# Altium schematic sheet YA-S-Microcontroller-V1.0.SchDoc: Yet Another IoT BroadRouter
size A4; Revision: 1.0; SheetNumber: 3; SheetTotal: 5
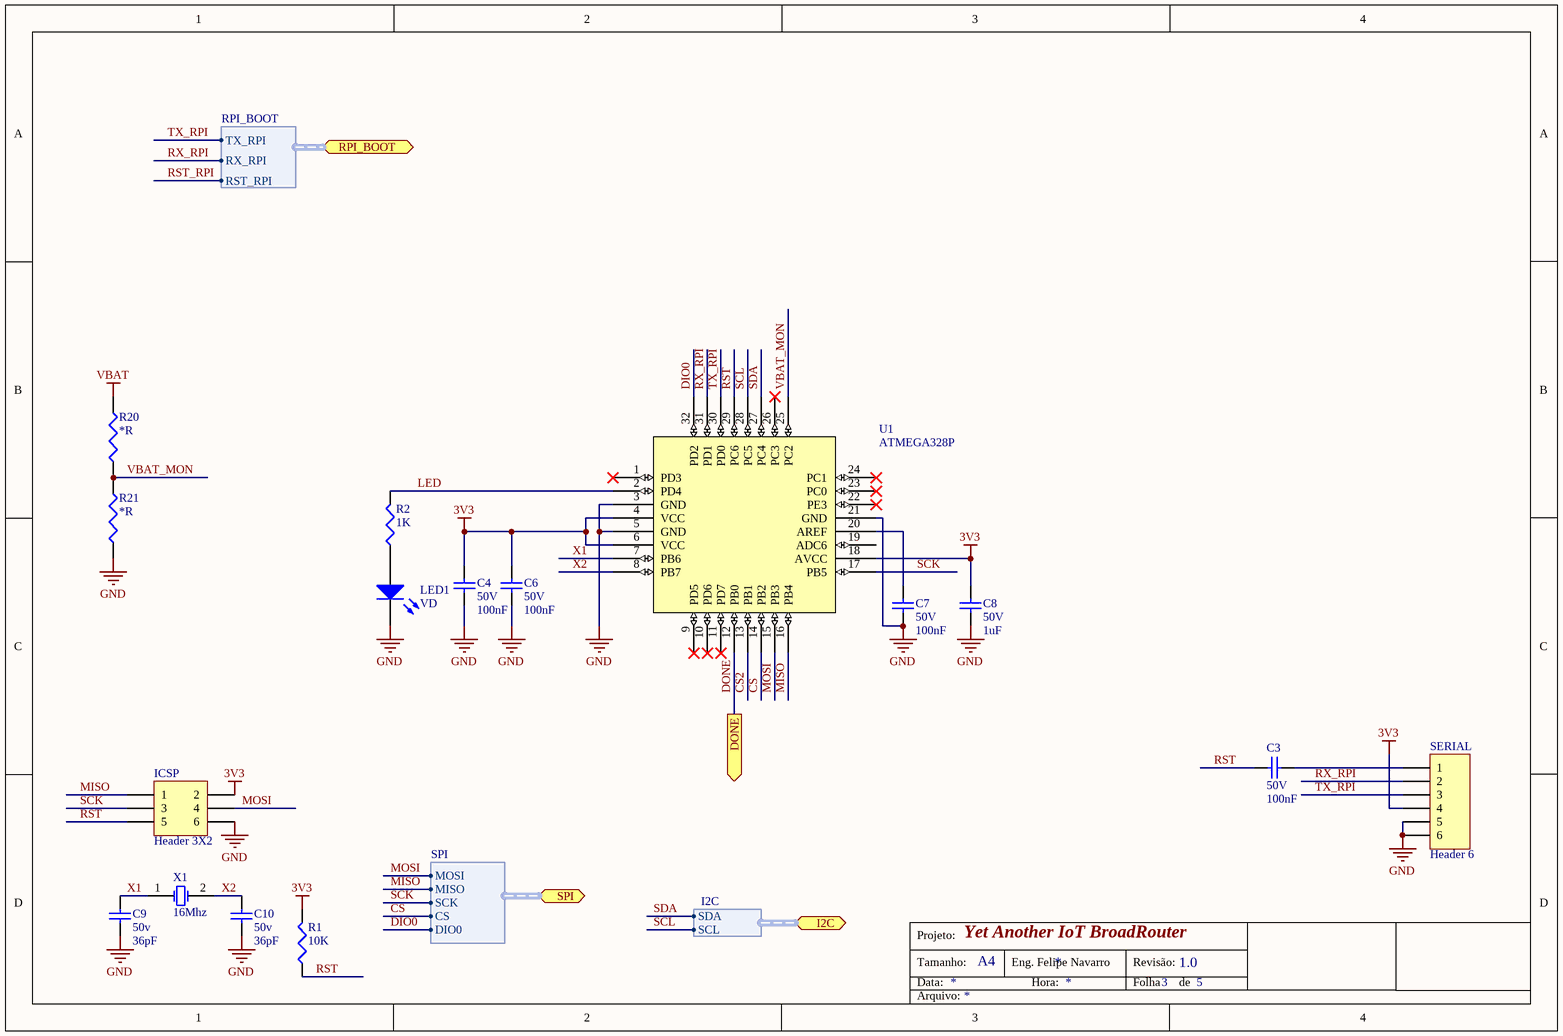
[diagram p0: YA-S-Microcontroller-V1.0.SchDoc]

## Parts
C3  value 100nF  Tensão: 50V  [CC0603]  (hidden comment: Capacitor Cerâmico)
C4  value 100nF  Tensão: 50V  [CC0603]  (hidden comment: Capacitor Cerâmico)
C6  value 100nF  Tensão: 50V  [CC0603]  (hidden comment: Capacitor Cerâmico)
C7  value 100nF  Tensão: 50V  [CC0603]  (hidden comment: Capacitor Cerâmico)
C8  value 1uF  Tensão: 50V  [CC0603]  (hidden comment: Capacitor Cerâmico)
C9  value 36pF  Tensão: 50v  [CC0603]  (hidden comment: Capacitor Cerâmico)
C10  value 36pF  Tensão: 50v  [CC0603]  (hidden comment: Capacitor Cerâmico)
ICSP  Header 3X2  [CONN HDR2X3]
LED1  value VD  [LED 0603]  (hidden comment: LED)
R1  value 10K  [CC0603]  (hidden comment: Resistor)
R2  value 1K  [CC0603]  (hidden comment: Resistor)
R20  value *R  [CC0603]  (hidden comment: Resistor)
R21  value *R  [CC0603]  (hidden comment: Resistor)
SERIAL  Header 6  [CONN HDR1X6]
U1  ATMEGA328P  [TQFP-32N]
X1  16Mhz  [HC/49US]

## Ports
DONE (out), I2C (harness I2C), RPI_BOOT (harness RPI_BOOT), SPI (harness SPI)

## Harnesses
I2C: SDA, SCL
SPI: MOSI, MISO, SCK, CS, DIO0
RPI_BOOT: TX_RPI, RX_RPI, RST_RPI

## Nets
3V3: C4.2 C6.2 C8.2 ICSP.2 R1.2 SERIAL.4 U1.4(VCC) U1.6(VCC) U1.18(AVCC)
GND: C4.1 C6.1 C7.1 C8.1 C9.1 C10.1 ICSP.6 LED1.2(K) R21.1 SERIAL.5 SERIAL.6 U1.3(GND) U1.5(GND) U1.21(GND)
VBAT: R20.2
CS: U1.14(PB2) ; port SPI.CS
CS2: U1.13(PB1)
DIO0: U1.32(PD2) ; port SPI.DIO0
DONE: U1.12(PB0) ; port DONE
LED: R2.2 U1.2(PD4)
MISO: ICSP.1 U1.16(PB4) ; port SPI.MISO
MOSI: ICSP.4 U1.15(PB3) ; port SPI.MOSI
RST: C3.2 ICSP.5 R1.1 U1.29(PC6)
RST_RPI: port RPI_BOOT.RST_RPI
RX_RPI: SERIAL.2 U1.31(PD1) ; port RPI_BOOT.RX_RPI
SCK: ICSP.3 U1.17(PB5) ; port SPI.SCK
SCL: U1.28(PC5) ; port I2C.SCL
SDA: U1.27(PC4) ; port I2C.SDA
TX_RPI: SERIAL.3 U1.30(PD0) ; port RPI_BOOT.TX_RPI
VBAT_MON: R20.1 R21.2 U1.25(PC2)
X1: C9.2 U1.7(PB6) X1.1(OSC1)
X2: C10.2 U1.8(PB7) X1.2(OSC2)
NetC3_1: C3.1 SERIAL.1
NetC7_2: C7.2 U1.20(AREF)
NetLED1_1: LED1.1(A) R2.1

Not connected (* = marked no-connect by the designer): U1 1(PD3)* 9(PD5)* 10(PD6)* 11(PD7)* 19(ADC6) 22(PE3)* 23(PC0)* 24(PC1)* 26(PC3)*

## Notes on the sheet
- Projeto:
- Tamanho:
- Data:
- A4
- Eng. Felipe Navarro
- Hora:
- Revisão:
- Folha
- de
- Arquivo:

## Library data of the parts
C3 C4 C6 C7 = Cap 100nF 50V 0603 X7R: Capacitor (Semiconductor SIM Model); Chinês: Local; ChinesePrice: 0,00250; Corrente: *A; Potência: *W; Obs:: X7R; Tolerância: ±10%; Supplier 1: Digi-Key; Supplier Part Number 1: 1276-1000-1-ND; ComponentLink1Description: Datasheet; ComponentLink1URL: D:\Tecnoclade\Datasheet\!DataMissing.pdf
C8 = Cap 1uF 50V 0603 X5R: Capacitor (Semiconductor SIM Model); Chinês: Local; ChinesePrice: 0,01100; Corrente: *A; Potência: *W; Obs:: X5R; Tolerância: ±10%; Supplier 1: Digi-Key; Supplier Part Number 1: 587-2400-1-ND; ComponentLink1Description: Datasheet; ComponentLink1URL: D:\Tecnoclade\Datasheet\!DataMissing.pdf
C9 C10 = Cap - $Val $V $Footprint $Classe_1: Capacitor (Semiconductor SIM Model); Chinês: ----; ChinesePrice: 0,00000; Corrente: *A; Potência: *W; Tolerância: ±*%; Supplier 1: Digi-Key; Supplier Part Number 1: 1276-1187-1-ND; Obs:: *; ComponentLink1Description: Datasheet; ComponentLink1URL: D:\Tecnoclade\Datasheet\!DataMissing.pdf
ICSP = Header 3X2: Header, 5-Pin, Dual row; ChinesePrice: 0,00000; Chinês: ----; Value: Macho; Obs:: Barra dupla de 40 pinos - ATENÇÃO; Corrente: *; Potência: *; Supplier 1: Digi-Key; Supplier Part Number 1: 609-3724-ND; Tensão: *; Tolerância: *; ComponentLink1Description: Datasheet; ComponentLink1URL: D:\Tecnoclade\Datasheet\!DataMissing.pdf
LED1 = LED 0603 VD 2V 75mW: ChinesePrice: 0,02810; Chinês: Local; Corrente: 20mA; Potência: 75mW; Tensão: 2V; Obs:: 35mcd@130º; Supplier 1: Digi-Key; Supplier Part Number 1: 160-1478-1-ND; Tolerância: *; ComponentLink1Description: Datasheet; ComponentLink1URL: D:\Tecnoclade\Datasheet\!DataMissing.pdf
R1 = Res 10K 1% 0603 1/10W: ChinesePrice: 0,00089; Chinês: Local; Corrente: *A; Potência: 1/10W; Tensão: *V; Tolerância: ±1%; Supplier 1: Digi-Key; Supplier Part Number 1: P10.0KHCT-ND; Obs: *; ComponentLink1Description: Datasheet; ComponentLink1URL: D:\Tecnoclade\Datasheet\!DataMissing.pdf
R2 = Res 1K 1% 0603 1/10W: ChinesePrice: 0,00089; Chinês: Local; Corrente: *A; Potência: 1/10W; Tensão: *V; Tolerância: ±1%; Supplier 1: Digi-Key; Supplier Part Number 1: RMCF0603FT1K00CT-ND; Obs: *; ComponentLink1Description: Datasheet; ComponentLink1URL: D:\Tecnoclade\Datasheet\!DataMissing.pdf
R20 R21 = Res - $Val $% $Footprint $Pot: ChinesePrice: 0,00000; Chinês: ----; Corrente: *A; Potência: 1/10W; Tensão: *V; Tolerância: ±*%; Supplier 1: Digi-Key; Supplier Part Number 1: --Del; Obs:: *; ComponentLink1Description: Datasheet; ComponentLink1URL: D:\Tecnoclade\Datasheet\!DataMissing.pdf
SERIAL = Header 6: Header, 6-Pin; ChinesePrice: 0,10000; Chinês: Proved - Local; Value: Barra de 40 pinos - ATENÇÃO; Corrente: *; Potência: *; Supplier 1: Digi-Key; Supplier Part Number 1: A26509-40-ND; Tensão: *; Obs:: *; Tolerância: *; ComponentLink1Description: Datasheet; ComponentLink1URL: D:\Tecnoclade\Datasheet\!DataMissing.pdf
U1 = ATMEGA328P: IC MCU 32KB FLASH 20MHZ 32TQFP; ChinesePrice: 0,00000; Chinês: ----; Supplier 1: Digi-Key; Supplier Part Number 1: ATMEGA328P-AN-ND; Tensão: *; Corrente: *; Potência: *; Value: *; Obs:: *; Tolerância: *; ComponentLink1Description: Datasheet; ComponentLink1URL: D:\Tecnoclade\Datasheet\
X1 = XTAL: Crystal Oscillator; ChinesePrice: 0,00000; Chinês: ----; Value: 20pF/40R; Corrente: *; Potência: *; Supplier 1: Digi-Key; Supplier Part Number 1: 535-10226-1-ND; Tensão: *; Obs:: *; Tolerância: *